# Altium schematic sheet ESP_SCHEMATIC.SchDoc
size A2; SheetNumber: 1; SheetTotal: 1
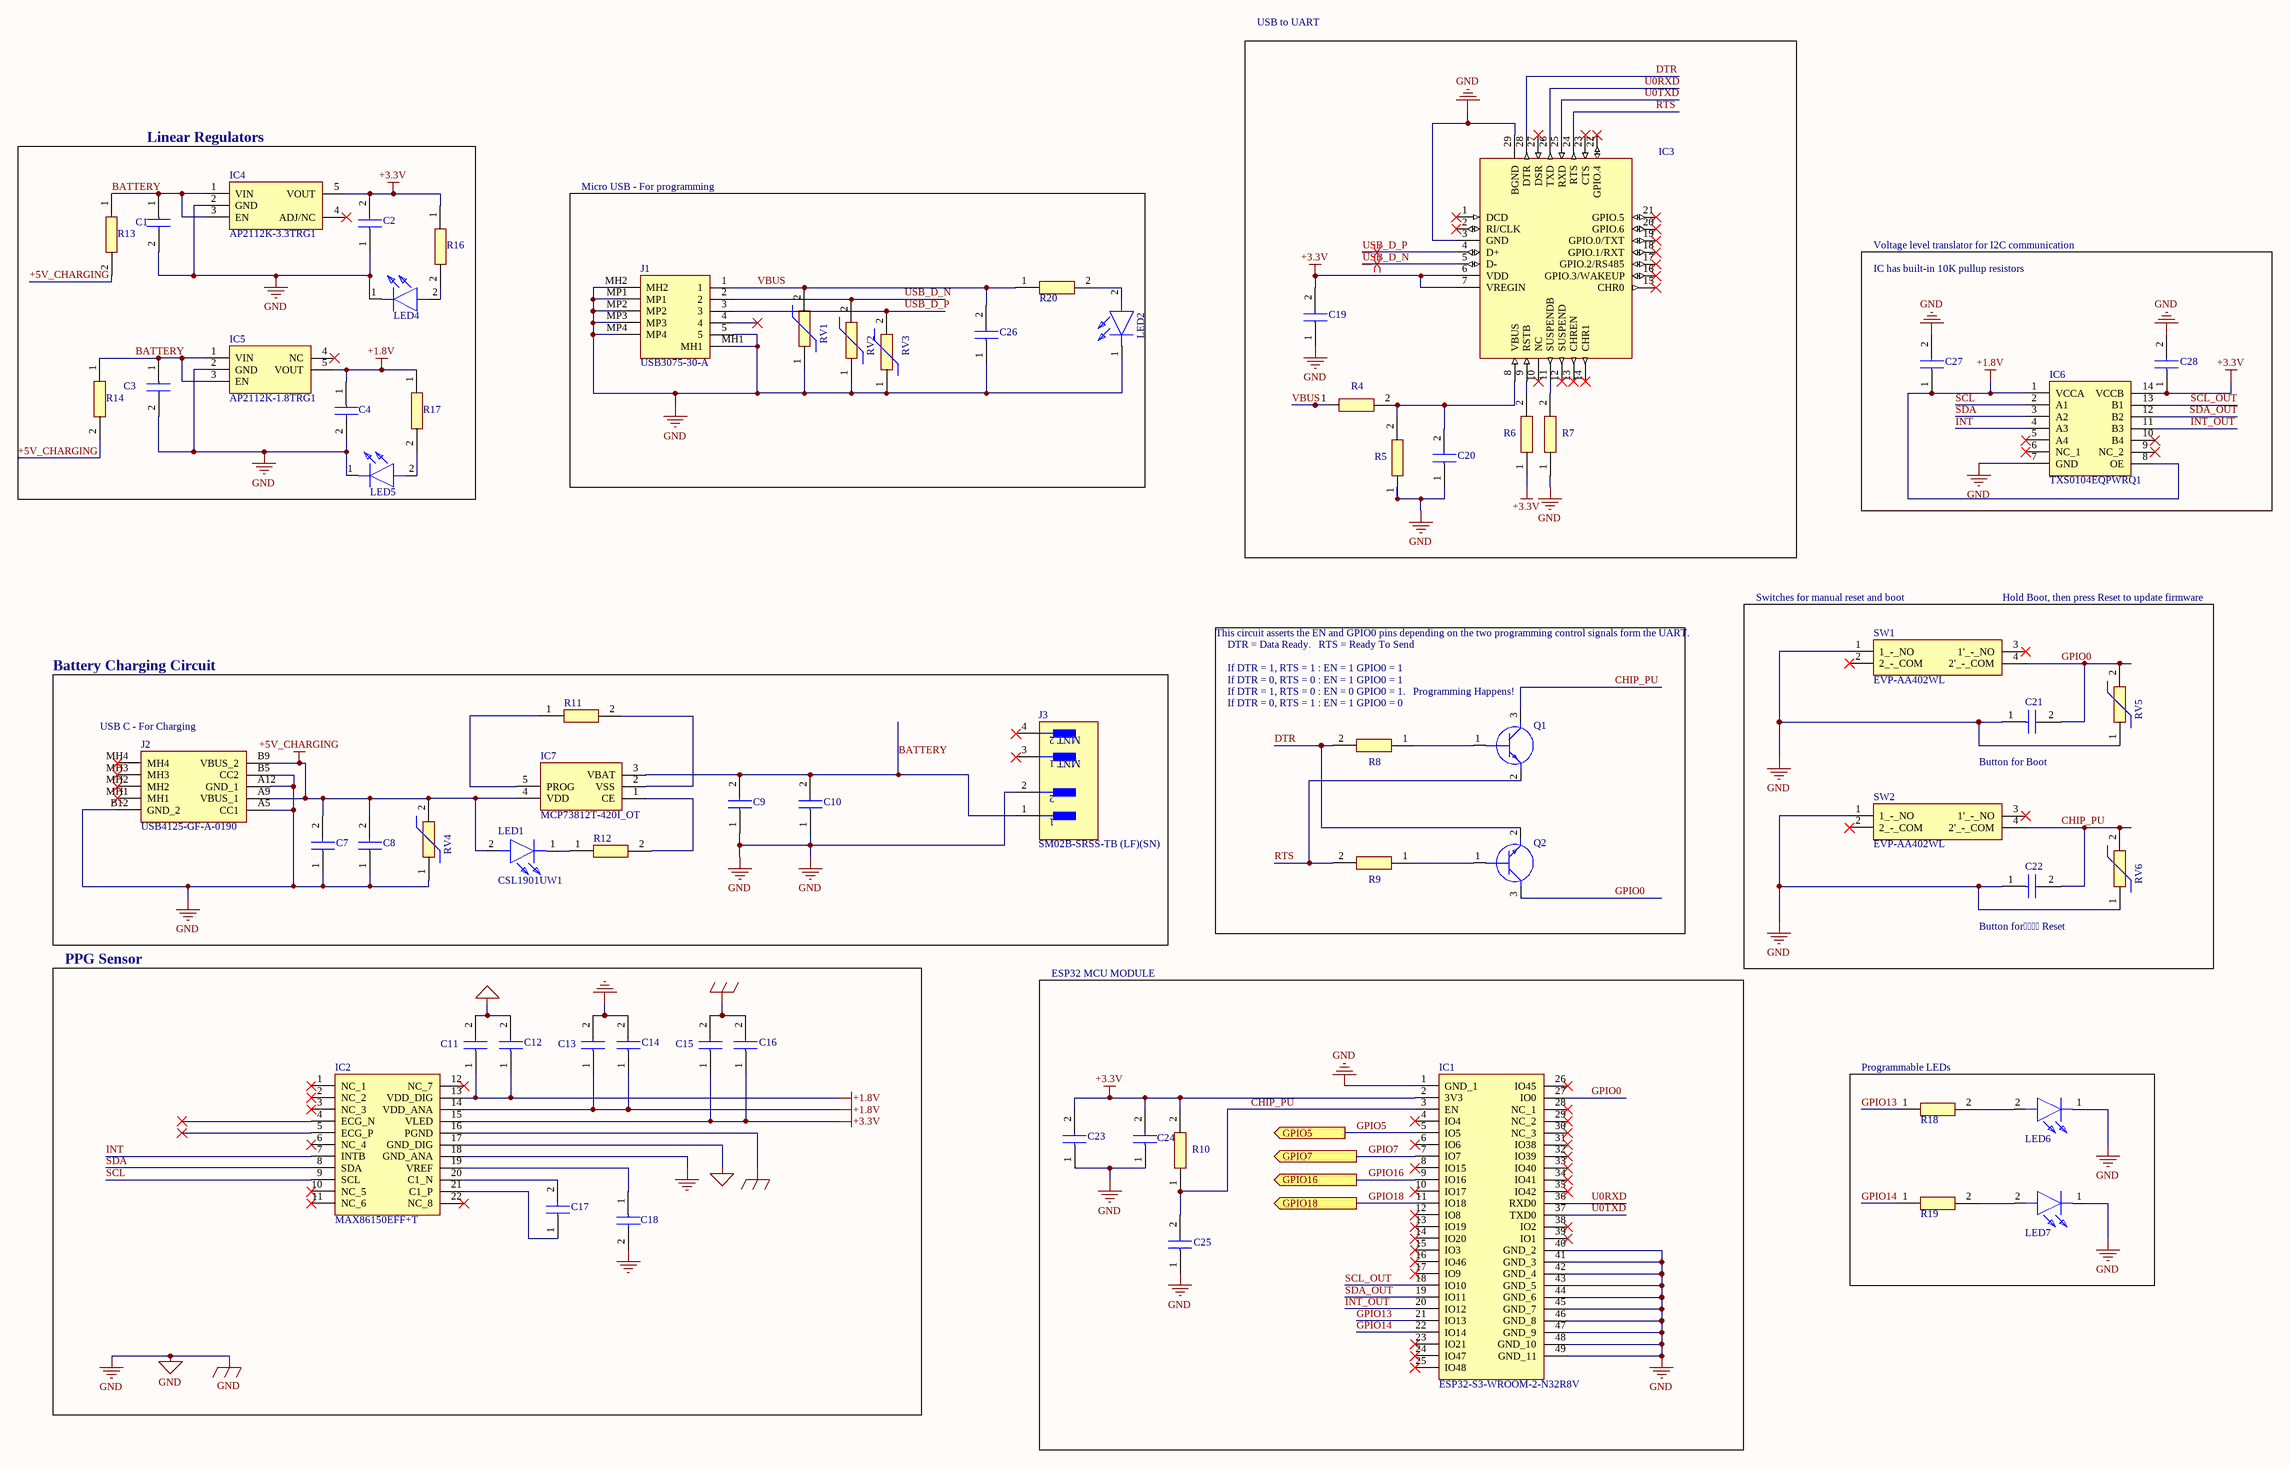
[diagram p0: ESP_SCHEMATIC.SchDoc]

## Parts
C1  CGA3E1X7R1C105K080AC  [CAPC1608X90N]  (value not drawn)
C2  GRM188R71A225KE15J  [CAPC1608X90N]  (value not drawn)
C3  CGA3E1X7R1C105K080AC  [CAPC1608X90N]  (value not drawn)
C4  CGA3E1X7R1C105K080AC  [CAPC1608X90N]  (value not drawn)
C7  C0603C104K8RAC  [CAPC1608X95N]  (value not drawn)
C8  GRM188R61E106KA73J  [CAPC1608X90N]  (value not drawn)
C9  C0603C104K8RAC  [CAPC1608X95N]  (value not drawn)
C10  GRM188R61E106KA73J  [CAPC1608X90N]  (value not drawn)
C11  C1608X5R1E475K080AC  [CAPC1608X80N]  (value not drawn)
C12  C0603C104K8RAC  [CAPC1608X95N]  (value not drawn)
C13  C1608X5R1E475K080AC  [CAPC1608X80N]  (value not drawn)
C14  C0603C104K8RAC  [CAPC1608X95N]  (value not drawn)
C15  GRM188R61E106KA73J  [CAPC1608X90N]  (value not drawn)
C16  C0603C104K8RAC  [CAPC1608X95N]  (value not drawn)
C17  CGA3E1X7R1C105K080AC  [CAPC1608X90N]  (value not drawn)
C18  CGA3E1X7R1C105K080AC  [CAPC1608X90N]  (value not drawn)
C19  GRM188R61E106MA73J  [CAPC1608X90N]  (value not drawn)
C20  GRT188R61C105KE13D  [CAPC1608X90N]  (value not drawn)
C21  C0603C104K5RAC3121  [CAPC1608X95N]  (value not drawn)
C22  C0603C104K5RAC3121  [CAPC1608X95N]  (value not drawn)
C23  C0603C104K8RAC  [CAPC1608X95N]  (value not drawn)
C24  GRM188R61E106KA73J  [CAPC1608X90N]  (value not drawn)
C25  C0603C105K4RACTU  [C0603]  (value not drawn)
C26  GRM188R61E106MA73J  [CAPC1608X90N]  (value not drawn)
C27  C0603C104K8RAC  [CAPC1608X95N]  (value not drawn)
C28  C0603C104K8RAC  [CAPC1608X95N]  (value not drawn)
IC1  ESP32-S3-WROOM-2-N32R8V  [ESP32S3WROOM2N32R8V]
IC2  MAX86150EFF+T  [MAX86150EFFT]
IC3  CP2102N-A02-GQFN28  [QFN50P500X500X80-29N-D]  (value not drawn)
IC4  AP2112K-3.3TRG1  [SOT95P282X130-5N]
IC5  AP2112K-1.8TRG1  [SOT95P285X140-5N]
IC6  TXS0104EQPWRQ1  [SOP65P640X120-14N]
IC7  MCP73812T-420I_OT  [SOT95P270X145-5N]
J1  USB3075-30-A  [USB307530A]
J2  USB4125-GF-A-0190  [USB4125GFA0190]
J3  SM02B-SRSS-TB (LF)(SN)  [FP-SM02B-SRSS-TB_LF_SN-MFG]
LED1  CSL1901UW1  [CSL1901UW1]
LED2  SMLD12BN1WT86  [LEDM168X65N]  (value not drawn)
LED4  CSL1901YW1  [CSL1901YW1]  (value not drawn)
LED5  CSL1901YW1  [CSL1901YW1]  (value not drawn)
LED6  CSL1901YW1  [CSL1901YW1]  (value not drawn)
LED7  CSL1901YW1  [CSL1901YW1]  (value not drawn)
Q1  KSC3265YMTF  [SOT96P237X111-3N]  (value not drawn)
Q2  KSC3265YMTF  [SOT96P237X111-3N]  (value not drawn)
R4  ERJUP3F2212V  [ERJUP3]  (value not drawn)
R5  ERJUP3F4752V  [ERJUP3]  (value not drawn)
R6  ERJUP3F1001V  [ERJUP3]  (value not drawn)
R7  ERJ-UP3J103V  [ERJUP3]  (value not drawn)
R8  ERJ-UP3J103V  [ERJUP3]  (value not drawn)
R9  ERJ-UP3J103V  [ERJUP3]  (value not drawn)
R10  ERJ-UP3J103V  [ERJUP3]  (value not drawn)
R11  ERJUP3F2001V  [ERJUP3]  (value not drawn)
R12  ERJUP3F1001V  [ERJUP3]  (value not drawn)
R13  ERA-3AEB101V  [ERA3AEB101V]  (value not drawn)
R14  ERA-3AEB101V  [ERA3AEB101V]  (value not drawn)
R16  RT0603BRE075KL  [RESC1608X55N]  (value not drawn)
R17  RT0603BRE075KL  [RESC1608X55N]  (value not drawn)
R18  RT0603BRE075KL  [RESC1608X55N]  (value not drawn)
R19  RT0603BRE075KL  [RESC1608X55N]  (value not drawn)
R20  RT0603BRE075KL  [RESC1608X55N]  (value not drawn)
RV1  CG0603MLC-05E  [VARC1608X55N]  (value not drawn)
RV2  CG0603MLC-05E  [VARC1608X55N]  (value not drawn)
RV3  CG0603MLC-05E  [VARC1608X55N]  (value not drawn)
RV4  CG0603MLC-05E  [VARC1608X55N]  (value not drawn)
RV5  CG0603MLC-05E  [VARC1608X55N]  (value not drawn)
RV6  CG0603MLC-05E  [VARC1608X55N]  (value not drawn)
SW1  EVP-AA402WL  [EVPAA]
SW2  EVP-AA402WL  [EVPAA]

## Blocks framed on the sheet
USB to UART: C19 C20 IC3 R4-R7
Linear Regulators: C1-C4 IC4 IC5 LED4 LED5 R13 R14 R16 R17
Micro USB - For programming: C26 J1 LED2 R20 RV1-RV3
Battery Charging Circuit: C7-C10 IC7 J2 J3 LED1 R11 R12 RV4
PPG Sensor: C11-C18 IC2
ESP32 MCU MODULE: C23-C25 IC1 R10
Programmable LEDs: LED6 LED7 R18 R19

## Ports
GPIO5 (out), GPIO7 (out), GPIO16 (out), GPIO18 (out)

## Nets
+1.8V: C4.1 C11.1 C12.1 C13.1 C14.1 C27.1 IC2.13(VDD_DIG) IC2.14(VDD_ANA) IC5.5(VOUT) IC6.1(VCCA) IC6.8(OE) R17.1
+3.3V: C2.2 C15.1 C16.1 C19.2 C23.2 C24.2 C28.1 IC1.2(3V3) IC2.15(VLED) IC3.6(VDD) IC3.7(VREGIN) IC4.5(VOUT) IC6.14(VCCB) R6.1 R10.2 R16.1
+5V_CHARGING: C7.2 C8.2 IC7.4(VDD) J2.A9(VBUS_1) J2.B9(VBUS_2) LED1.2(A) R13.2 R14.2 RV4.2
GND: C1.2 C2.1 C3.2 C4.2 C7.1 C8.1 C9.1 C10.1 C11.2 C12.2 C13.2 C14.2 C15.2 C16.2 C18.2 C19.1 C20.1 C21.1 C22.1 C23.1 C24.1 C25.1 C26.1 C27.2 C28.2 IC1.1(GND_1) IC1.40(GND_2) IC1.41(GND_3) IC1.42(GND_4) IC1.43(GND_5) IC1.44(GND_6) IC1.45(GND_7) IC1.46(GND_8) IC1.47(GND_9) IC1.48(GND_10) IC1.49(GND_11) IC2.16(PGND) IC2.17(GND_DIG) IC2.18(GND_ANA) IC3.3(GND) IC3.29(BGND) IC4.2(GND) IC5.2(GND) IC6.7(GND) J1.5 J1.MH1 J1.MH2 J1.MP1 J1.MP2 J1.MP3 J1.MP4 J2.A5(CC1) J2.A12(GND_1) J2.B5(CC2) J2.B12(GND_2) J3.2 LED2.1(K) LED4.1(K) LED5.1(K) LED6.1(K) LED7.1(K) R5.1 R7.1 RV1.1 RV2.1 RV3.1 RV4.1 RV5.1 RV6.1 SW1.1(1_-_NO) SW2.1(1_-_NO)
BATTERY: C1.1 C3.1 C9.2 C10.2 IC4.1(VIN) IC4.3(EN) IC5.1(VIN) IC5.3(EN) IC7.3(VBAT) J3.1 R13.1 R14.1
CHIP_PU: C22.2 C25.2 IC1.3(EN) Q1.3(C) R10.1 RV6.2 SW2.4(2'_-_COM)
DTR: IC3.28(DTR) Q2.2(E) R8.2
GPIO0: C21.2 IC1.27(IO0) Q2.3(C) RV5.2 SW1.4(2'_-_COM)
GPIO5: IC1.5(IO5) ; port GPIO5
GPIO7: IC1.7(IO7) ; port GPIO7
GPIO13: IC1.21(IO13) R18.1
GPIO14: IC1.22(IO14) R19.1
GPIO16: IC1.9(IO16) ; port GPIO16
GPIO18: IC1.11(IO18) ; port GPIO18
INT: IC2.7(INTB) IC6.4(A3)
INT_OUT: IC1.20(IO12) IC6.11(B3)
RTS: IC3.24(RTS) Q1.2(E) R9.2
SCL: IC2.9(SCL) IC6.2(A1)
SCL_OUT: IC1.18(IO10) IC6.13(B1)
SDA: IC2.8(SDA) IC6.3(A2)
SDA_OUT: IC1.19(IO11) IC6.12(B2)
U0RXD: IC1.36(RXD0) IC3.26(TXD)
U0TXD: IC1.37(TXD0) IC3.25(RXD)
USB_D_N: IC3.5(D-) J1.2 RV2.2
USB_D_P: IC3.4(D+) J1.3 RV3.2
VBUS: C26.2 J1.1 R4.1 R20.1 RV1.2
NetC17_1: C17.1 IC2.21(C1_P)
NetC17_2: C17.2 IC2.20(C1_N)
NetC18_1: C18.1 IC2.19(VREF)
NetC20_2: C20.2 IC3.8(VBUS) R4.2 R5.2
NetIC3_9: IC3.9(RSTB) R6.2
NetIC3_11: IC3.11(SUSPENDB) R7.2
NetIC7_1: IC7.1(CE) R12.2
NetIC7_2: IC7.2(VSS) R11.2
NetIC7_5: IC7.5(PROG) R11.1
NetLED1_1: LED1.1(K) R12.1
NetLED2_2: LED2.2(A) R20.2
NetLED4_2: LED4.2(A) R16.2
NetLED5_2: LED5.2(A) R17.2
NetLED6_2: LED6.2(A) R18.2
NetLED7_2: LED7.2(A) R19.2
NetQ1_1: Q1.1(B) R8.1
NetQ2_1: Q2.1(B) R9.1

Not connected (* = marked no-connect by the designer): IC1 4(IO4)* 6(IO6)* 8(IO15)* 10(IO17)* 12(IO8)* 13(IO19)* 14(IO20)* 15(IO3)* 16(IO46)* 17(IO9)* 23(IO21)* 24(IO47)* 25(IO48)* 26(IO45)* 28(NC_1)* 29(NC_2)* 30(NC_3)* 31(IO38)* 32(IO39)* 33(IO40)* 34(IO41)* 35(IO42)* 38(IO2)* 39(IO1)*; IC2 1(NC_1)* 2(NC_2)* 3(NC_3)* 4(ECG_N)* 5(ECG_P)* 6(NC_4)* 10(NC_5)* 11(NC_6)* 12(NC_7)* 22(NC_8)*; IC3 1(DCD)* 2(RI/CLK)* 10(NC)* 12(SUSPEND)* 13(CHREN)* 14(CHR1)* 15(CHR0)* 16(GPIO.3/WAKEUP)* 17(GPIO.2/RS485)* 18(GPIO.1/RXT)* 19(GPIO.0/TXT)* 20(GPIO.6)* 21(GPIO.5)* 22(GPIO.4)* 23(CTS)* 27(DSR)*; IC4 4(ADJ/NC)*; IC5 4(NC)*; IC6 5(A4)* 6(NC_1)* 9(NC_2)* 10(B4)*; J1 4*; J2 MH1* MH2* MH3* MH4*; J3 3(MNT_1)* 4(MNT_2)*; SW1 2(2_-_COM)* 3(1'_-_NO)*; SW2 2(2_-_COM)* 3(1'_-_NO)*

## Layout directives
differential pair: USB_D_N, USB_D_P

## Notes on the sheet
- Voltage level translator for I2C communication
- IC has built-in 10K pullup resistors
- This circuit asserts the EN and GPIO0 pins depending on the two programming control signals form the UART.
- DTR = Data Ready.   RTS = Ready To Send
- Switches for manual reset and boot
- Hold Boot, then press Reset to update firmware
- If DTR = 1, RTS = 1 : EN = 1 GPIO0 = 1
- If DTR = 0, RTS = 0 : EN = 1 GPIO0 = 1
- (near Q1) If DTR = 1, RTS = 0 : EN = 0 GPIO0 = 1.   Programming Happens!
- (near R8) If DTR = 0, RTS = 1 : EN = 1 GPIO0 = 0
- (near J2) USB C - For Charging
- Button for Boot
- Button for Reset

## Library data of the parts
C1 C3 C4 C17 C18 = CGA3E1X7R1C105K080AC: Capacitor; Manufacturer_Name: TDK; Datasheet Link: http://docs-europe.electrocomponents.com/webdocs/14e9/0900766b814e9125.pdf; Height: 0.9mm; Manufacturer_Part_Number: CGA3E1X7R1C105K080AC; Mouser Part Number: 810-CGA3E1X7R1C105AC; Mouser Price/Stock: https://www.mouser.co.uk/ProductDetail/TDK/CGA3E1X7R1C105K080AC?qs=XHchNesRtUbBVNsGg9%252BP9g%3D%3D; Arrow Part Number: CGA3E1X7R1C105K080AC; Arrow Price/Stock: https://www.arrow.com/en/products/cga3e1x7r1c105k080ac/tdk?region=nac
C2 = GRM188R71A225KE15J: Capacitor; Manufacturer_Name: Murata Electronics; Datasheet Link: https://psearch.en.murata.com/capacitor/product/GRM188R71A225KE15%23.html; Height: 0.9mm; Manufacturer_Part_Number: GRM188R71A225KE15J; Mouser Part Number: 81-GRM188R71A225KE5J; Mouser Price/Stock: https://www.mouser.co.uk/ProductDetail/Murata-Electronics/GRM188R71A225KE15J?qs=UOvNgVTuGCp28jccFPFZuA%3D%3D; Arrow Part Number: GRM188R71A225KE15J; Arrow Price/Stock: https://www.arrow.com/en/products/grm188r71a225ke15j/murata-manufacturing?region=nac
C7 C9 C12 C14 C16 C23 C27 C28 = C0603C104K8RAC: Capacitor; Manufacturer_Name: KEMET; Datasheet Link: https://www.kemet.com/specsheet/C0603C104K8RAC%7BBULK%7D; Height: 0.95mm; Manufacturer_Part_Number: C0603C104K8RAC; Mouser Part Number: 80-C0603C104K8RAC; Mouser Price/Stock: https://www.mouser.co.uk/ProductDetail/KEMET/C0603C104K8RAC?qs=JxH5GSBHSCStdUs4AtW0Gg%3D%3D; Arrow Part Number: C0603C104K8RAC; Arrow Price/Stock: https://www.arrow.com/en/products/c0603c104k8rac/kemet-corporation?region=nac
C8 C10 C15 C24 = GRM188R61E106KA73J: Capacitor; Manufacturer_Name: Murata Electronics; Height: 0.9mm; Manufacturer_Part_Number: GRM188R61E106KA73J; Mouser Part Number: 81-GRM188R61E106KA3J; Mouser Price/Stock: https://www.mouser.co.uk/ProductDetail/Murata-Electronics/GRM188R61E106KA73J?qs=5aG0NVq1C4xEV8YyiSS7mg%3D%3D; Arrow Part Number: GRM188R61E106KA73J; Arrow Price/Stock: https://www.arrow.com/en/products/grm188r61e106ka73j/murata-manufacturing?region=nac
C11 C13 = C1608X5R1E475K080AC: Capacitor; Manufacturer_Name: TDK; Datasheet Link: https://product.tdk.com/info/en/catalog/datasheets/mlcc_commercial_midvoltage_en.pdf; Height: 0.8mm; Manufacturer_Part_Number: C1608X5R1E475K080AC; Mouser Part Number: 810-C1608X5R1E475K; Mouser Price/Stock: https://www.mouser.co.uk/ProductDetail/TDK/C1608X5R1E475K080AC?qs=dfay7wIA1uHUGZGvnFtOyQ%3D%3D; Arrow Part Number: C1608X5R1E475K080AC; Arrow Price/Stock: https://www.arrow.com/en/products/c1608x5r1e475k080ac/tdk?region=nac
C19 C26 = GRM188R61E106MA73J: Capacitor; Manufacturer_Name: Murata Electronics; Datasheet Link: https://psearch.en.murata.com/capacitor/product/GRM188R61E106MA73%23.html; Height: 0.9mm; Manufacturer_Part_Number: GRM188R61E106MA73J; Mouser Part Number: 81-GRM188R61E106MA3J; Mouser Price/Stock: https://www.mouser.co.uk/ProductDetail/Murata-Electronics/GRM188R61E106MA73J?qs=hNud%2FORuBR2%252B%252BY67hhW1nA%3D%3D; Arrow Part Number: GRM188R61E106MA73J; Arrow Price/Stock: https://www.arrow.com/en/products/grm188r61e106ma73j/murata-manufacturing?region=nac
C20 = GRT188R61C105KE13D: Capacitor; Manufacturer_Name: Murata Electronics; Datasheet Link: https://psearch.en.murata.com/capacitor/product/GRT188R61C105KE13%23.html?excid=ww_pa-o_ow_ctl_c03e-9_2017; Height: 0.9mm; Manufacturer_Part_Number: GRT188R61C105KE13D; Mouser Part Number: 81-GRT188R61C105KE3D; Mouser Price/Stock: https://www.mouser.co.uk/ProductDetail/Murata-Electronics/GRT188R61C105KE13D?qs=drgMNd%252BkGPOepOW7YqGRfg%3D%3D; Arrow Part Number: GRT188R61C105KE13D; Arrow Price/Stock: https://www.arrow.com/en/products/grt188r61c105ke13d/murata-manufacturing
C21 C22 = C0603C104K5RAC3121: Capacitor; Manufacturer_Name: KEMET; Datasheet Link: https://mouser.componentsearchengine.com/Datasheets/1/C0603C104K5RAC3121.pdf; Height: 0.95mm; Manufacturer_Part_Number: C0603C104K5RAC3121; Mouser Part Number: 80-C603C104K5RAC3121; Mouser Price/Stock: https://www.mouser.co.uk/ProductDetail/KEMET/C0603C104K5RAC3121?qs=oBCMsStVSxe1EkGyoyETtg%3D%3D; Arrow Part Number: C0603C104K5RAC3121; Arrow Price/Stock: https://www.arrow.com/en/products/c0603c104k5rac3121/kemet-corporation?region=nac
C25 = C0603C105K4RACTU: Capacitor; Manufacturer_Name: KEMET; Datasheet Link: https://content.kemet.com/datasheets/KEM_C1002_X7R_SMD.pdf; Height: 0.87mm; Manufacturer_Part_Number: C0603C105K4RACTU; Mouser Part Number: 80-C0603C105K4R; Mouser Price/Stock: https://www.mouser.co.uk/ProductDetail/KEMET/C0603C105K4RACTU?qs=STjISULpmtZNMAZGR4X39Q%3D%3D; Arrow Part Number: C0603C105K4RACTU; Arrow Price/Stock: https://www.arrow.com/en/products/c0603c105k4ractu/kemet-corporation?region=nac
IC1 = ESP32-S3-WROOM-2-N32R8V: Integrated Circuit; Manufacturer_Name: Espressif Systems; Datasheet Link: https://www.espressif.com/sites/default/files/documentation/esp32-s3-wroom-2_datasheet_en.pdf; Height: 3.25mm; Manufacturer_Part_Number: ESP32-S3-WROOM-2-N32R8V; Mouser Part Number: 356-ESP3S3WRM2N32R8V; Mouser Price/Stock: https://www.mouser.co.uk/ProductDetail/Espressif-Systems/ESP32-S3-WROOM-2-N32R8V?qs=Li%252BoUPsLEntC3FaT%2FvCeug%3D%3D
IC2 = MAX86150EFF+T: Integrated Circuit; Manufacturer_Name: Analog Devices; Datasheet Link: https://datasheets.maximintegrated.com/en/ds/MAX86150.pdf; Height: 1.4mm; Manufacturer_Part_Number: MAX86150EFF+T; Mouser Part Number: 700-MAX86150EFF+T; Mouser Price/Stock: https://www.mouser.co.uk/ProductDetail/Analog-Devices-Maxim-Integrated/MAX86150EFF%2bT?qs=CfuTe0PnivoQJnGe4c6AkQ%3D%3D; Arrow Part Number: MAX86150EFF+T; Arrow Price/Stock: https://www.arrow.com/en/products/max86150efft/maxim-integrated?region=nac
IC3 = CP2102N-A02-GQFN28: Integrated Circuit; Manufacturer_Name: Silicon Labs; Datasheet Link: https://componentsearchengine.com/Datasheets/2/CP2102N-A02-GQFN28.pdf; Height: 0.8mm; Manufacturer_Part_Number: CP2102N-A02-GQFN28; Mouser Part Number: 634-CP2102NA02GQFN28; Mouser Price/Stock: https://www.mouser.co.uk/ProductDetail/Silicon-Labs/CP2102N-A02-GQFN28?qs=u16ybLDytRaSBkSkyjYFiA%3D%3D; Arrow Part Number: CP2102N-A02-GQFN28; Arrow Price/Stock: https://www.arrow.com/en/products/cp2102n-a02-gqfn28/silicon-labs?region=nac
IC4 = AP2112K-3.3TRG1: Integrated Circuit; Manufacturer_Name: Diodes Inc.; Datasheet Link: http://uk.rs-online.com/web/p/products/8283509; Height: 1.3mm; Manufacturer_Part_Number: AP2112K-3.3TRG1; Mouser Part Number: 621-AP2112K-3.3TRG1; Mouser Price/Stock: https://www.mouser.co.uk/ProductDetail/Diodes-Incorporated/AP2112K-3.3TRG1?qs=x6A8l6qLYDDPYHosCdzh%2FA%3D%3D; Arrow Part Number: AP2112K-3.3TRG1; Arrow Price/Stock: https://www.arrow.com/en/products/ap2112k-3.3trg1/diodes-incorporated?region=nac
IC5 = AP2112K-1.8TRG1: Integrated Circuit; Manufacturer_Name: Diodes Inc.; Datasheet Link: https://www.diodes.com/assets/Datasheets/AP2112.pdf; Height: 1.4mm; Manufacturer_Part_Number: AP2112K-1.8TRG1; Mouser Part Number: 621-AP2112K-1.8TRG1; Mouser Price/Stock: https://www.mouser.co.uk/ProductDetail/Diodes-Incorporated/AP2112K-1.8TRG1?qs=x6A8l6qLYDBx1xhw8AX2cw%3D%3D; Arrow Part Number: AP2112K-1.8TRG1; Arrow Price/Stock: https://www.arrow.com/en/products/ap2112k-1.8trg1/diodes-incorporated?region=nac
IC6 = TXS0104EQPWRQ1: Integrated Circuit; Manufacturer_Name: Texas Instruments; Datasheet Link: http://www.ti.com/lit/gpn/txs0104e-q1; Height: 1.2mm; Manufacturer_Part_Number: TXS0104EQPWRQ1; Mouser Part Number: 595-TXS0104EQPWRQ1; Mouser Price/Stock: https://www.mouser.co.uk/ProductDetail/Texas-Instruments/TXS0104EQPWRQ1?qs=%2Fd%252BFzHvH4c2rOFEu5n8Xkg%3D%3D; Arrow Part Number: TXS0104EQPWRQ1; Arrow Price/Stock: https://www.arrow.com/en/products/txs0104eqpwrq1/texas-instruments?region=nac
IC7 = MCP73812T-420I_OT: Integrated Circuit; Manufacturer_Name: Microchip; Manufacturer_Part_Number: MCP73812T-420I/OT; Datasheet Link: https://datasheet.datasheetarchive.com/originals/distributors/SFDatasheet-4/sf-00090104.pdf; Height: 1.45mm; Mouser Part Number: 579-MCP73812T-420IOT; Mouser Price/Stock: https://www.mouser.co.uk/ProductDetail/Microchip-Technology/MCP73812T-420I-OT?qs=tZia49mH7IIojPkz8UZ7Mg%3D%3D; Arrow Part Number: MCP73812T-420I/OT; Arrow Price/Stock: https://www.arrow.com/en/products/mcp73812t-420iot/microchip-technology?region=nac
J1 = USB3075-30-A: Connector; Manufacturer_Name: GCT (GLOBAL CONNECTOR TECHNOLOGY); Datasheet Link: https://componentsearchengine.com/Datasheets/2/USB3075-30-A.pdf; Height: 2.7mm; Manufacturer_Part_Number: USB3075-30-A; Mouser Part Number: 640-USB3075-30-A; Mouser Price/Stock: https://www.mouser.co.uk/ProductDetail/GCT/USB3075-30-A?qs=KUoIvG%2F9IlbGMJplbp1ybA%3D%3D
J2 = USB4125-GF-A-0190: Connector; Manufacturer_Name: GCT (GLOBAL CONNECTOR TECHNOLOGY); Datasheet Link: https://eu.mouser.com/datasheet/2/837/usb4125-2448699.pdf; Manufacturer_Part_Number: USB4125-GF-A-0190; Mouser Part Number: 640-USB4125-GF-A-190; Mouser Price/Stock: https://www.mouser.co.uk/ProductDetail/GCT/USB4125-GF-A-0190?qs=QNEnbhJQKvbCz4hEJBS24w%3D%3D
J3 = CMP-17439-000368-1: CONN HEADER SMD R/A 2POS 1MM; Max Current Rating: 1A; Voltage Rating (AC): 50V; Current Rating: 700mA; Contact Resistance: 40mR; Number of Positions: 2; Insulation Resistance: 100MR; Fastening Type: Pull; Orientation: Right Angle; Insulation Color: Natural; Insulation Material: Nylon; Connector Type: Header; Contact Type: Male Pin; Number of Rows: 1; Housing Material: Polyamide; Contact Material: Copper Alloy; Mount: Surface Mount; Packaging: Tape and Reel; Lead Pitch: 1mm; REACH SVHC: No SVHC; Flammability Rating: UL94 V-0; Termination: Solder; Series: SR; Length: 4mm; Color: Natural; Min Operating Temperature: -25°C; Pitch: 1mm; Depth: 4.95mm; Contact Plating: Tin; Lead Free: Lead Free; Max Operating Temperature: 85°C; Contact Finish - Mating: TIN; Material: Polyamide; Voltage Rating: 50V; Max Voltage Rating (AC): 50V; Housing Color: Beige; Contact Shape: Square; Number of Contacts: 2
LED1 = CSL1901UW1: LED; Manufacturer_Name: ROHM Semiconductor; Datasheet Link: https://www.mouser.kr/datasheet/2/348/csl1901uw1_e-3006038.pdf; Height: 0.65mm; Manufacturer_Part_Number: CSL1901UW1; Mouser Part Number: 755-CSL1901UW1; Mouser Price/Stock: https://www.mouser.co.uk/ProductDetail/ROHM-Semiconductor/CSL1901UW1?qs=vvQtp7zwQdNEDNe2oY5WlQ%3D%3D
LED2 = SMLD12BN1WT86: LED; Manufacturer_Name: ROHM Semiconductor; Datasheet Link: https://datasheet.datasheetarchive.com/originals/distributors/Datasheets_SAMA/8f824a900f8c9a143b1c3640e6aee7b7.pdf; Height: 0.65mm; Manufacturer_Part_Number: SMLD12BN1WT86; Mouser Part Number: 755-SMLD12BN1WT86; Mouser Price/Stock: https://www.mouser.co.uk/ProductDetail/ROHM-Semiconductor/SMLD12BN1WT86?qs=qSfuJ%252Bfl%2Fd43hcPp9hYPwA%3D%3D
LED4-LED7 = CSL1901YW1: LED; Manufacturer_Name: ROHM Semiconductor; Datasheet Link: https://www.rohm.com/datasheet?p=CSL1901YW&dist=Digi-key&media=referral&source=digi-key.com&campaign=Digi-key; Height: 0.65mm; Manufacturer_Part_Number: CSL1901YW1; Mouser Part Number: 755-CSL1901YW1; Mouser Price/Stock: https://www.mouser.co.uk/ProductDetail/ROHM-Semiconductor/CSL1901YW1?qs=vvQtp7zwQdO0NUeC1uqWRA%3D%3D
Q1 Q2 = KSC3265YMTF: Transistor BJT NPN; Manufacturer_Name: onsemi; Datasheet Link: https://www.onsemi.com/pdf/datasheet/ksc3265-d.pdf; Height: 1.11mm; Manufacturer_Part_Number: KSC3265YMTF; Mouser Part Number: 512-KSC3265YMTF; Mouser Price/Stock: https://www.mouser.co.uk/ProductDetail/onsemi-Fairchild/KSC3265YMTF?qs=ljbEvF4DwONyf%2FfRDGs9vw%3D%3D; Arrow Part Number: KSC3265YMTF; Arrow Price/Stock: https://www.arrow.com/en/products/ksc3265ymtf/on-semiconductor?region=europe
R4 = ERJUP3F2212V: Resistor; Manufacturer_Name: Panasonic; Datasheet Link: https://industrial.panasonic.com/cdbs/wwwdata/pdf/RDP0000/AOA0000C337.pdf; Height: 0.55mm; Manufacturer_Part_Number: ERJUP3F2212V
R5 = ERJUP3F4752V: Resistor; Manufacturer_Name: Panasonic; Datasheet Link: https://industrial.panasonic.com/cdbs/wwwdata/pdf/RDP0000/AOA0000C337.pdf; Height: 0.55mm; Manufacturer_Part_Number: ERJUP3F4752V
R6 R12 = ERJUP3F1001V: Resistor; Manufacturer_Name: Panasonic; Datasheet Link: https://industrial.panasonic.com/cdbs/wwwdata/pdf/RDP0000/AOA0000C337.pdf; Height: 0.55mm; Manufacturer_Part_Number: ERJUP3F1001V
R7-R10 = ERJ-UP3J103V: Resistor; Manufacturer_Name: Panasonic; Datasheet Link: https://industrial.panasonic.com/cdbs/www-data/pdf/RDP0000/AOA0000C337.pdf; Height: 0.55mm; Manufacturer_Part_Number: ERJ-UP3J103V; Mouser Part Number: 667-ERJ-UP3J103V; Mouser Price/Stock: https://www.mouser.co.uk/ProductDetail/Panasonic/ERJ-UP3J103V?qs=GedFDFLaBXEhCQ7XYsRS5A%3D%3D; Arrow Part Number: ERJ-UP3J103V; Arrow Price/Stock: https://www.arrow.com/en/products/erj-up3j103v/panasonic?region=nac
R11 = ERJUP3F2001V: Resistor; Manufacturer_Name: Panasonic; Datasheet Link: https://industrial.panasonic.com/cdbs/wwwdata/pdf/RDP0000/AOA0000C337.pdf; Height: 0.55mm; Manufacturer_Part_Number: ERJUP3F2001V
R13 R14 = ERA-3AEB101V: Resistor; Manufacturer_Name: Panasonic; Datasheet Link: https://industrial.panasonic.com/cdbs/www-data/pdf/RDM0000/AOA0000C307.pdf; Height: 0.55mm; Manufacturer_Part_Number: ERA-3AEB101V; Mouser Part Number: 667-ERA-3AEB101V; Mouser Price/Stock: https://www.mouser.co.uk/ProductDetail/Panasonic/ERA-3AEB101V?qs=1VWA5LkbEaor%2FEcdBRYgKw%3D%3D; Arrow Part Number: ERA-3AEB101V; Arrow Price/Stock: https://www.arrow.com/en/products/era3aeb101v/panasonic?region=nac
R16-R20 = RT0603BRE075KL: Resistor; Manufacturer_Name: KEMET; Datasheet Link: https://datasheet.datasheetarchive.com/originals/distributors/Datasheets_SAMA/a1f8f48f216d234b3e6a96d43a77a0c1.pdf; Height: 0.55mm; Manufacturer_Part_Number: RT0603BRE075KL; Mouser Part Number: 603-RT0603BRE075KL; Mouser Price/Stock: https://www.mouser.co.uk/ProductDetail/YAGEO/RT0603BRE075KL?qs=acBVhj9v9XV8K9glB49uvw%3D%3D; Arrow Part Number: RT0603BRE075KL; Arrow Price/Stock: https://www.arrow.com/en/products/rt0603bre075kl/yageo?region=nac
RV1-RV6 = CG0603MLC-05E: Varistor; Manufacturer_Name: Bourns; Datasheet Link: http://www.farnell.com/datasheets/1785244.pdf; Height: 0.55mm; Manufacturer_Part_Number: CG0603MLC-05E; Mouser Part Number: 652-CG0603MLC-05E; Mouser Price/Stock: https://www.mouser.co.uk/ProductDetail/Bourns/CG0603MLC-05E?qs=lDok7oSghXVLNKMK69q%252BFQ%3D%3D; Arrow Part Number: CG0603MLC-05E; Arrow Price/Stock: https://www.arrow.com/en/products/cg0603mlc-05e/bourns?region=nac
SW1 SW2 = EVP-AA402WL: Switch; Manufacturer_Name: Panasonic; Datasheet Link: http://www.farnell.com/datasheets/2609096.pdf?_ga=2.89858395.1909122740.1531313473-167411096.1502103357; Manufacturer_Part_Number: EVP-AA402WL